# EAGLE design midi10trigger (EAGLE 9.3.1)
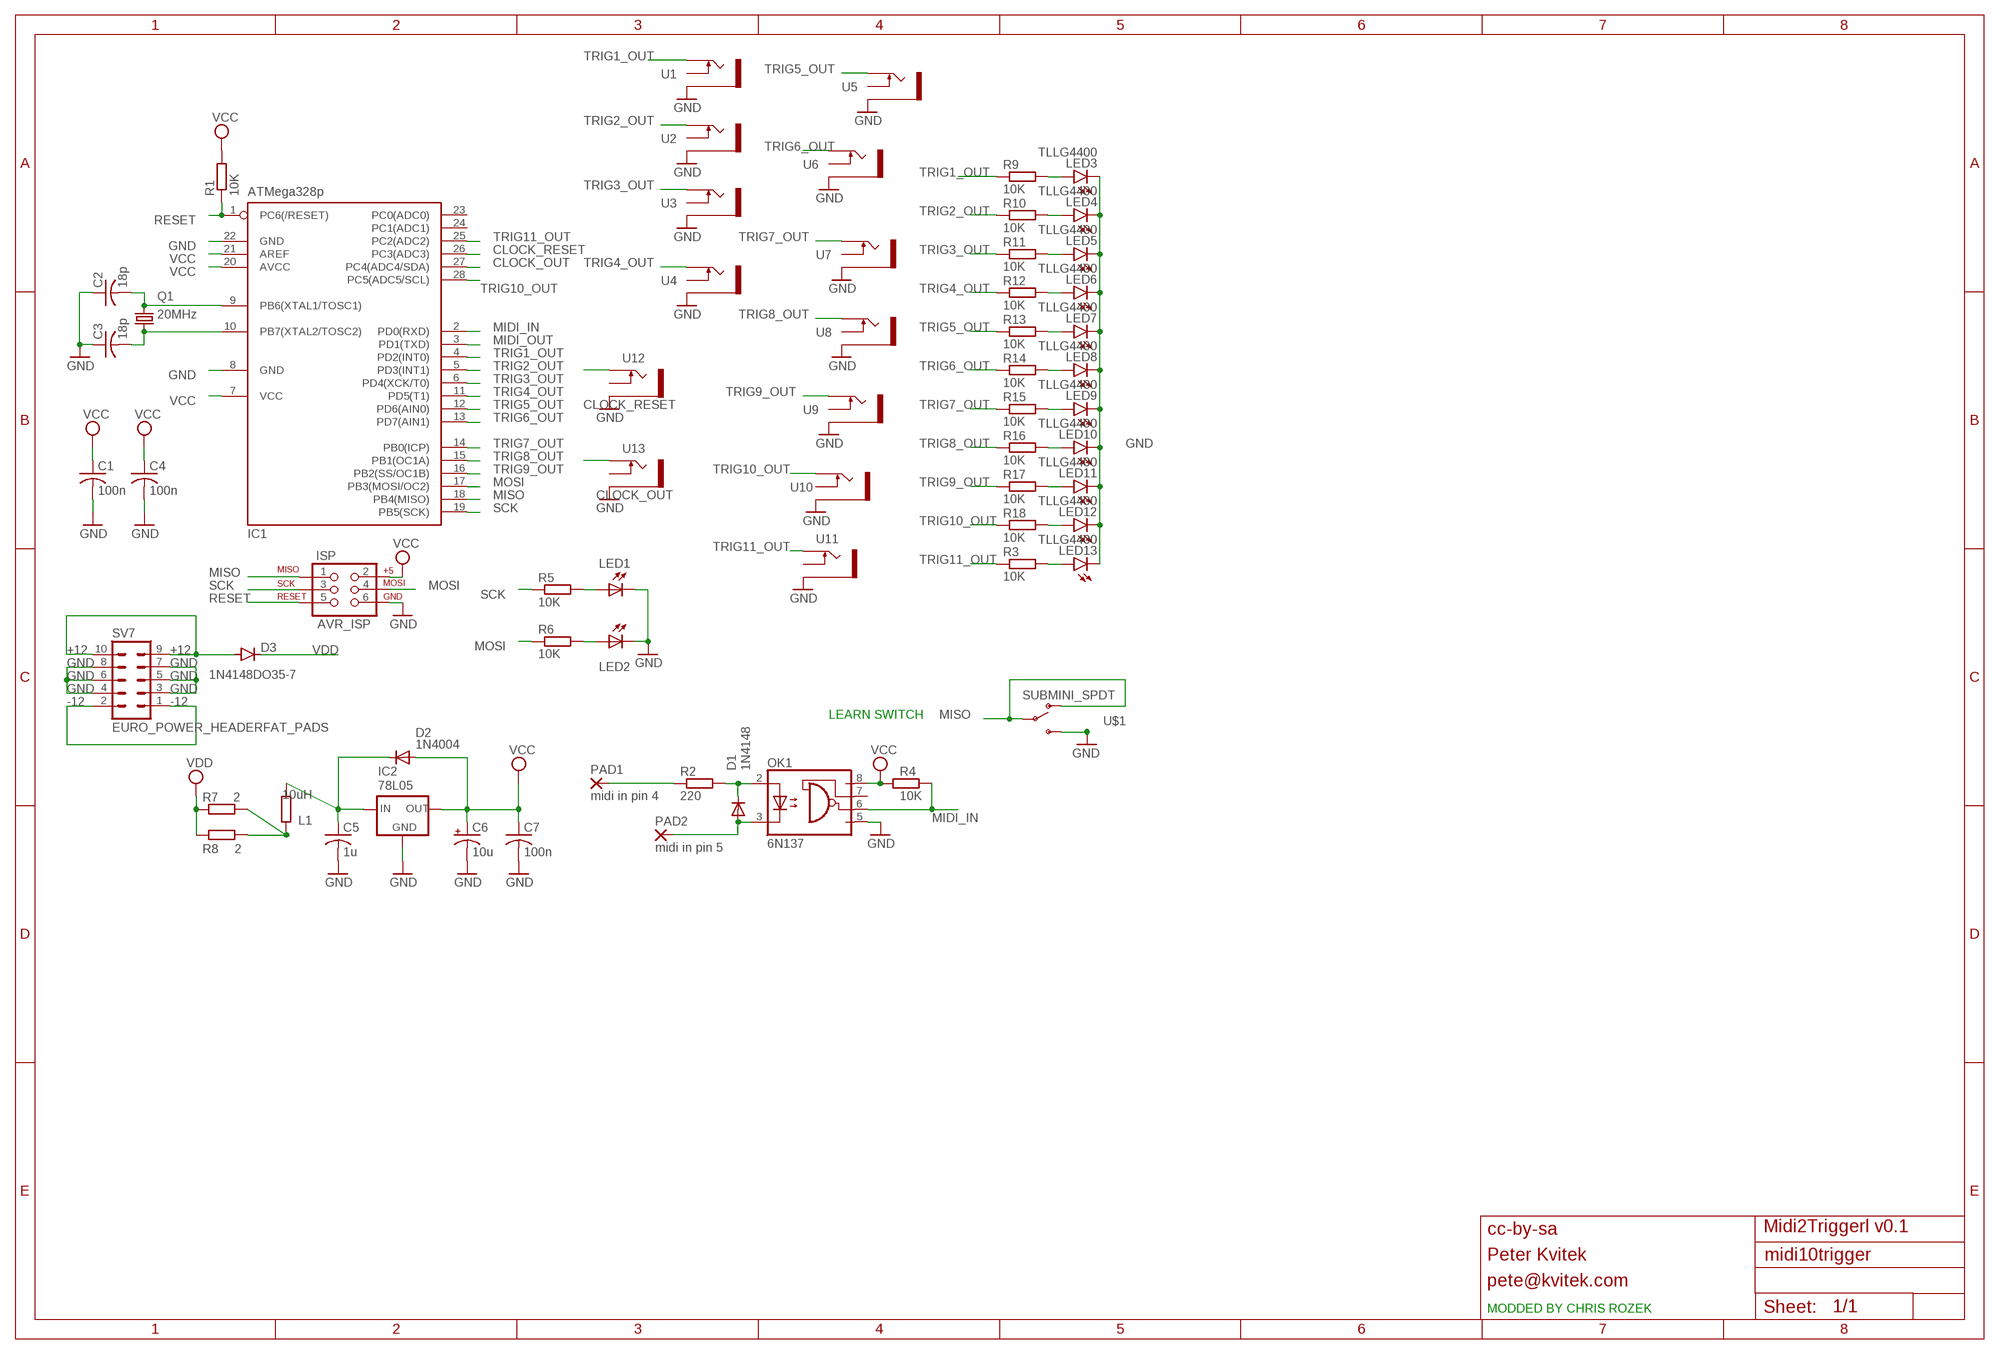
[diagram p0: schematic, sheet 1]

## Parts
C1  100n  C-US025-025X050  [C025-025X050]
C2  18p  C-US025-025X050  [C025-025X050]
C3  18p  C-US025-025X050  [C025-025X050]
C4  100n  C-US025-025X050  [C025-025X050]
C5  1u  C-US025-025X050  [C025-025X050]
C6  10u  CPOL-USE2.5-5  [E2,5-5]
C7  100n  C-US025-025X050  [C025-025X050]
D1  1N4148  DIODE-D-5  [D-5]
D2  1N4004  [DO41-10]
D3  1N4148DO35-7  [DO35-7]
IC1  ATMega328p  MEGA8-P  [DIL28-3]
IC2  78L05  78LXX  [78LXX]
ISP  AVR_ISP  AVR_SPI_PRG_6PTH  [2X3]
L1  10uH  RESISTORVERTICAL  [VERTICAL_RESISTOR]
LED1  LED3MM  [LED3MM]
LED2  LED3MM  [LED3MM]
LED3  TLLG4400  [LED3MM]
LED4  TLLG4400  [LED3MM]
LED5  TLLG4400  [LED3MM]
LED6  TLLG4400  [LED3MM]
LED7  TLLG4400  [LED3MM]
LED8  TLLG4400  [LED3MM]
LED9  TLLG4400  [LED3MM]
LED10  TLLG4400  [LED3MM]
LED11  TLLG4400  [LED3MM]
LED12  TLLG4400  [LED3MM]
LED13  TLLG4400  [LED3MM]
OK1  6N137  [DIL08]
PAD1  midi in pin 4  2,54/1,1  [2,54/1,1]
PAD2  midi in pin 5  2,54/1,1  [2,54/1,1]
Q1  20MHz  CRYSTALHC49U-V  [HC49U-V]
R1  10K  RESISTORVERTICAL  [VERTICAL_RESISTOR]
R2  220  RESISTORVERTICAL  [VERTICAL_RESISTOR]
R3  10K  RESISTORVERTICAL  [VERTICAL_RESISTOR]
R4  10K  RESISTORVERTICAL  [VERTICAL_RESISTOR]
R5  10K  RESISTORVERTICAL  [VERTICAL_RESISTOR]
R6  10K  RESISTORVERTICAL  [VERTICAL_RESISTOR]
R7  2  RESISTORVERTICAL  [VERTICAL_RESISTOR]
R8  2  RESISTORVERTICAL  [VERTICAL_RESISTOR]
R9  10K  RESISTORVERTICAL  [VERTICAL_RESISTOR]
R10  10K  RESISTORVERTICAL  [VERTICAL_RESISTOR]
R11  10K  RESISTORVERTICAL  [VERTICAL_RESISTOR]
R12  10K  RESISTORVERTICAL  [VERTICAL_RESISTOR]
R13  10K  RESISTORVERTICAL  [VERTICAL_RESISTOR]
R14  10K  RESISTORVERTICAL  [VERTICAL_RESISTOR]
R15  10K  RESISTORVERTICAL  [VERTICAL_RESISTOR]
R16  10K  RESISTORVERTICAL  [VERTICAL_RESISTOR]
R17  10K  RESISTORVERTICAL  [VERTICAL_RESISTOR]
R18  10K  RESISTORVERTICAL  [VERTICAL_RESISTOR]
SV7  EURO_POWER_HEADERFAT_PADS  [EURO_PWR_HEADER_FAT]
U1  THONKICONNNEW  [WQP-PJ301M-12_JACK]
U2  THONKICONNNEW  [WQP-PJ301M-12_JACK]
U3  THONKICONNNEW  [WQP-PJ301M-12_JACK]
U4  THONKICONNNEW  [WQP-PJ301M-12_JACK]
U5  THONKICONNNEW  [WQP-PJ301M-12_JACK]
U6  THONKICONNNEW  [WQP-PJ301M-12_JACK]
U7  THONKICONNNEW  [WQP-PJ301M-12_JACK]
U8  THONKICONNNEW  [WQP-PJ301M-12_JACK]
U9  THONKICONNNEW  [WQP-PJ301M-12_JACK]
U10  THONKICONNNEW  [WQP-PJ301M-12_JACK]
U11  THONKICONNNEW  [WQP-PJ301M-12_JACK]
U12  THONKICONNNEW  [WQP-PJ301M-12_JACK]
U13  THONKICONNNEW  [WQP-PJ301M-12_JACK]
U$1  SUBMINI_SPDT  [SUBMINI_TOGGLE]

## Nets
+12: D3.A SV7.9 SV7.10
-12: SV7.1 SV7.2
CLOCK_OUT: IC1.27(PC4(ADC4/SDA)) U13.P$1_TIP(TIP)
CLOCK_RESET: IC1.26(PC3(ADC3)) U12.P$1_TIP(TIP)
GND: C1.2 C2.1 C3.1 C4.2 C5.2 C6.- C7.2 IC1.8(GND) IC1.22(GND) IC2.GND ISP.6 LED1.K(C) LED2.K(C) LED3.K(C) LED4.K(C) LED5.K(C) LED6.K(C) LED7.K(C) LED8.K(C) LED9.K(C) LED10.K(C) LED11.K(C) LED12.K(C) LED13.K(C) OK1.5(GND) SV7.3 SV7.4 SV7.5 SV7.6 SV7.7 SV7.8 U1.P$3_SLEEVE(SLEEVE) U2.P$3_SLEEVE(SLEEVE) U3.P$3_SLEEVE(SLEEVE) U4.P$3_SLEEVE(SLEEVE) U5.P$3_SLEEVE(SLEEVE) U6.P$3_SLEEVE(SLEEVE) U7.P$3_SLEEVE(SLEEVE) U8.P$3_SLEEVE(SLEEVE) U9.P$3_SLEEVE(SLEEVE) U10.P$3_SLEEVE(SLEEVE) U11.P$3_SLEEVE(SLEEVE) U12.P$3_SLEEVE(SLEEVE) U13.P$3_SLEEVE(SLEEVE) U$1.3(S)
MIDI_IN: IC1.2(PD0(RXD)) OK1.6(VO) R4.2
MIDI_OUT: IC1.3(PD1(TXD))
MISO: IC1.18(PB4(MISO)) ISP.1 U$1.1(O) U$1.COM(COMMON)
MOSI: IC1.17(PB3(MOSI/OC2)) ISP.4 R6.1
N$1: L1.1 R7.2 R8.2
N$2: D1.C OK1.2(A) R2.2
N$3: LED13.A R3.2
N$4: LED1.A R5.2
N$5: LED2.A R6.2
N$17: LED3.A R9.2
N$18: LED4.A R10.2
N$19: LED5.A R11.2
N$20: LED6.A R12.2
N$21: LED7.A R13.2
N$22: LED8.A R14.2
N$23: LED9.A R15.2
N$24: LED10.A R16.2
N$25: LED11.A R17.2
N$26: LED12.A R18.2
N$72: PAD1.1(P) R2.1
N$73: D1.A OK1.3(C) PAD2.1(P)
N$82: C3.2 IC1.10(PB7(XTAL2/TOSC2)) Q1.1
N$83: C2.2 IC1.9(PB6(XTAL1/TOSC1)) Q1.2
RESET: IC1.1(PC6(/RESET)) ISP.5 R1.1
SCK: IC1.19(PB5(SCK)) ISP.3 R5.1
TRIG1_OUT: IC1.4(PD2(INT0)) R9.1 U1.P$1_TIP(TIP)
TRIG2_OUT: IC1.5(PD3(INT1)) R10.1 U2.P$1_TIP(TIP)
TRIG3_OUT: IC1.6(PD4(XCK/T0)) R11.1 U3.P$1_TIP(TIP)
TRIG4_OUT: IC1.11(PD5(T1)) R12.1 U4.P$1_TIP(TIP)
TRIG5_OUT: IC1.12(PD6(AIN0)) R13.1 U5.P$1_TIP(TIP)
TRIG6_OUT: IC1.13(PD7(AIN1)) R14.1 U6.P$1_TIP(TIP)
TRIG7_OUT: IC1.14(PB0(ICP)) R15.1 U7.P$1_TIP(TIP)
TRIG8_OUT: IC1.15(PB1(OC1A)) R16.1 U8.P$1_TIP(TIP)
TRIG9_OUT: IC1.16(PB2(SS/OC1B)) R17.1 U9.P$1_TIP(TIP)
TRIG10_OUT: IC1.28(PC5(ADC5/SCL)) R18.1 U10.P$1_TIP(TIP)
TRIG11_OUT: IC1.25(PC2(ADC2)) R3.1 U11.P$1_TIP(TIP)
VCC: C1.1 C4.1 C6.+ C7.1 D2.A IC1.7(VCC) IC1.20(AVCC) IC1.21(AREF) IC2.OUT ISP.2 OK1.8(VCC) R1.2 R4.1
VDD: D3.C R7.1 R8.1
VREG_IN: C5.1 D2.C IC2.IN L1.2
Unconnected: IC1.23(PC0(ADC0)) IC1.24(PC1(ADC1)) OK1.7(VE) U1.P$2_SWITCH(SWITCH) U2.P$2_SWITCH(SWITCH) U3.P$2_SWITCH(SWITCH) U4.P$2_SWITCH(SWITCH) U5.P$2_SWITCH(SWITCH) U6.P$2_SWITCH(SWITCH) U7.P$2_SWITCH(SWITCH) U8.P$2_SWITCH(SWITCH) U9.P$2_SWITCH(SWITCH) U10.P$2_SWITCH(SWITCH) U11.P$2_SWITCH(SWITCH) U12.P$2_SWITCH(SWITCH) U13.P$2_SWITCH(SWITCH)

## Notes on the sheet
- LEARN SWITCH
- cc-by-sa | Midi2Triggerl v0.1
- Peter Kvitek
- pete@kvitek.com
- MODDED BY CHRIS ROZEK

## Library data of the parts
C1-C5 C7 = rcl:C-US: CAPACITOR, American symbol
C6 = rcl:CPOL-US: POLARIZED CAPACITOR, American symbol
D1 = diode:DIODE-: DIODE
D2 = diode:1N4004: DIODE general purpose rectifier, 1 A
D3 = diode:1N4148: DIODE high speed (Philips)
IC1 = atmel:MEGA8-P: MICROCONTROLLER 8 Kbytes FLASH, 1 kbytes SRAM, 512 bytes EEPROM, USART, 4-channel 10 bit ADC, 2-channel 8 bit ADC Pin compatible with Atmega48, ATMega88, ATMega168 Source: avr.lbr; OC_FARNELL: unknown; OC_NEWARK: unknown
IC2 = v-reg:78LXX: VOLTAGE REGULATOR
ISP = SparkFun:AVR_SPI_PRG_6: AVR ISP 6 Pin This is the reduced ISP connector for AVR programming. Common on Arduino. This footprint will take up less PCB space and can be used with a 10-pin to 6-pin adapter such as SKU: BOB-08508
L1 R1-R18 = MusicThingModular:RESISTOR: Standard resistor, various versions
LED1 LED2 = led:LED: LED OSRAM: - CHIPLED LG R971, LG N971, LY N971, LG Q971, LY Q971, LO R971, LY R971 LH N974, LH R974 LS Q976, LO Q976, LY Q976 LO Q996 - Hyper CHIPLED LW Q18S LB Q993, LB Q99A, LB R99A - SideLED LS A670, LO A670, LY A670, LG A670, LP A670 LB A673, LV A673, LT A673, LW A673 LH A674 LY A675 LS A676, LA A676, LO A676, LY A676, LW A676 LS A679, LY A679, LG A679 - Hyper Micro SIDELED® LS Y876, LA Y876, LO Y876, LY Y876 LT Y87S - SmartLED LW L88C, LW L88S LB L89C, LB L89S, LG L890 LS L89K, LO L89K, LY L89K LS L896, LA L896, LO L896, LY L896 - TOPLED LS T670, LO T670, LY T670, LG T670, LP T670 LSG T670, LSP T670, LSY T670, LOP T670, LYG T670 LG T671, LOG T671, LSG T671 LB T673, LV T673, LT T673, LW T673 LH T674 LS T676, LA T676, LO T676, LY T676, LB T676, LH T676, LSB T676, LW T676 LB T67C, LV T67C, LT T67C, LS T67K, LO T67K, LY T67K, LW E67C LS E67B, LA E67B, LO E67B, LY E67B, LB E67C, LV E67C, LT E67C LW T67C LS T679, LY T679, LG T679 LS T770, LO T770, LY T770, LG T770, LP T770 LB T773, LV T773, LT T773, LW T773 LH T774 LS E675, LA E675, LY E675, LS T675 LS T776, LA T776, LO T776, LY T776, LB T776 LHGB T686 LT T68C, LB T68C - Hyper Mini TOPLED® LB M676 - Mini TOPLED Santana® LG M470 LS M47K, LO M47K, LY M47K Source: http://www.osram.convergy.de LUXEON: - LUMILED® LXK2-PW12-R00, LXK2-PW12-S00, LXK2-PW14-U00, LXK2-PW14-V00 LXK2-PM12-R00, LXK2-PM12-S00, LXK2-PM14-U00 LXK2-PE12-Q00, LXK2-PE12-R00, LXK2-PE12-S00, LXK2-PE14-T00, LXK2-PE14-U00 LXK2-PB12-K00, LXK2-PB12-L00, LXK2-PB12-M00, LXK2-PB14-N00, LXK2-PB14-P00, LXK2-PB14-Q00 LXK2-PR12-L00, LXK2-PR12-M00, LXK2-PR14-Q00, LXK2-PR14-R00 LXK2-PD12-Q00, LXK2-PD12-R00, LXK2-PD12-S00 LXK2-PH12-R00, LXK2-PH12-S00 LXK2-PL12-P00, LXK2-PL12-Q00, LXK2-PL12-R00 Source: www.luxeon.com KINGBRIGHT: KA-3528ASYC Source: www.kingbright.com
LED3-LED13 = led:TLLG4400: Low Current (2mA) LED 3 mm Tinted Diffused Package color GREEN Source: Data sheet <http://www.farnell.com/datasheets/391098.pdf>; MF: VISHAY SEMICONDUCTOR; OC_FARNELL: 1612435
OK1 = kvitekp:6N137: MOTOROLA OPTO COUPLER; MPN: 6N137; OC_FARNELL: 1328376; OC_NEWARK: 52M1895
PAD1 PAD2 = wirepad:2,54/1,1: THROUGH-HOLE PAD
Q1 = crystal:CRYSTAL: CRYSTAL; OC_FARNELL: 1666969; OC_NEWARK: unknown
SV7 = MusicThingModular:EURO_POWER_HEADER: Power Header 10 pin power header for Eurorack Power Supplies Variants with fatter pads for easier soldering, and the LOCK variant which has 5mil offset pins to hold the component in place before soldering
U1-U13 = MusicThingModular:THONKICONN: 3.5mm socket for Eurorack modular synths
U$1 = MusicThingModular:SUBMINI_SPDT

## Net classes
0 default: width 0.635 mm, drill 0.254 mm, clearance 0.254 mm
1 bigger: width 1.27 mm, drill 0.508 mm, clearance 0.635 mm

## Board
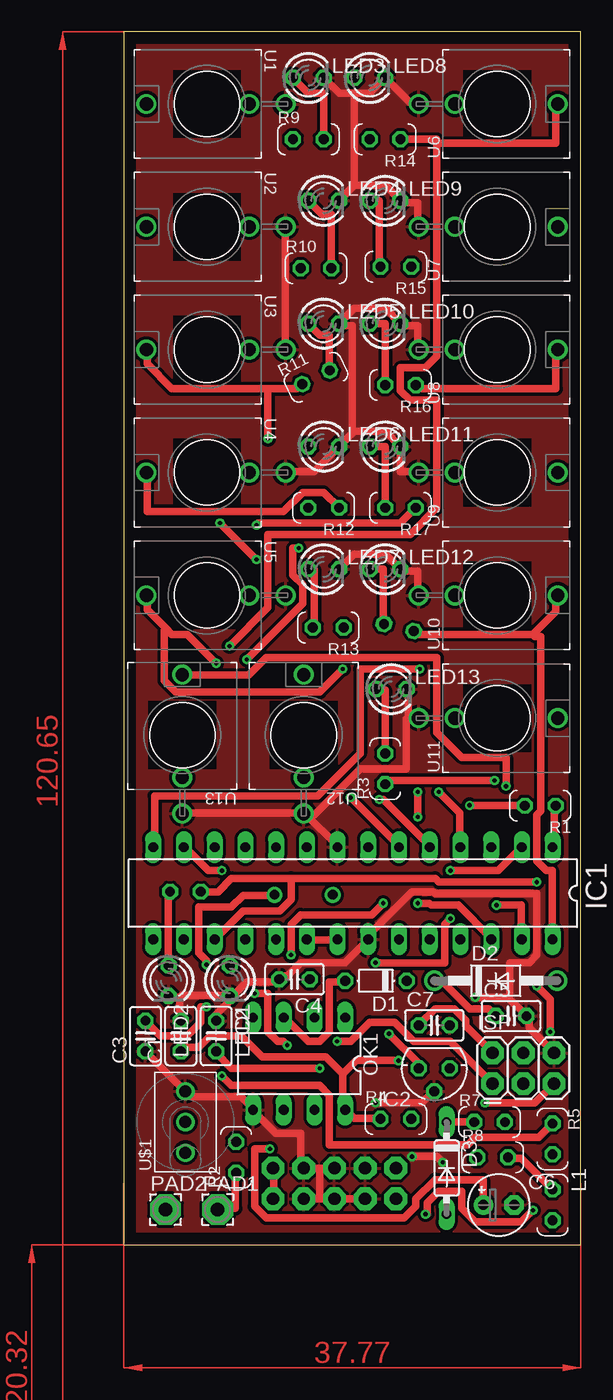
[diagram p1: board, top side]
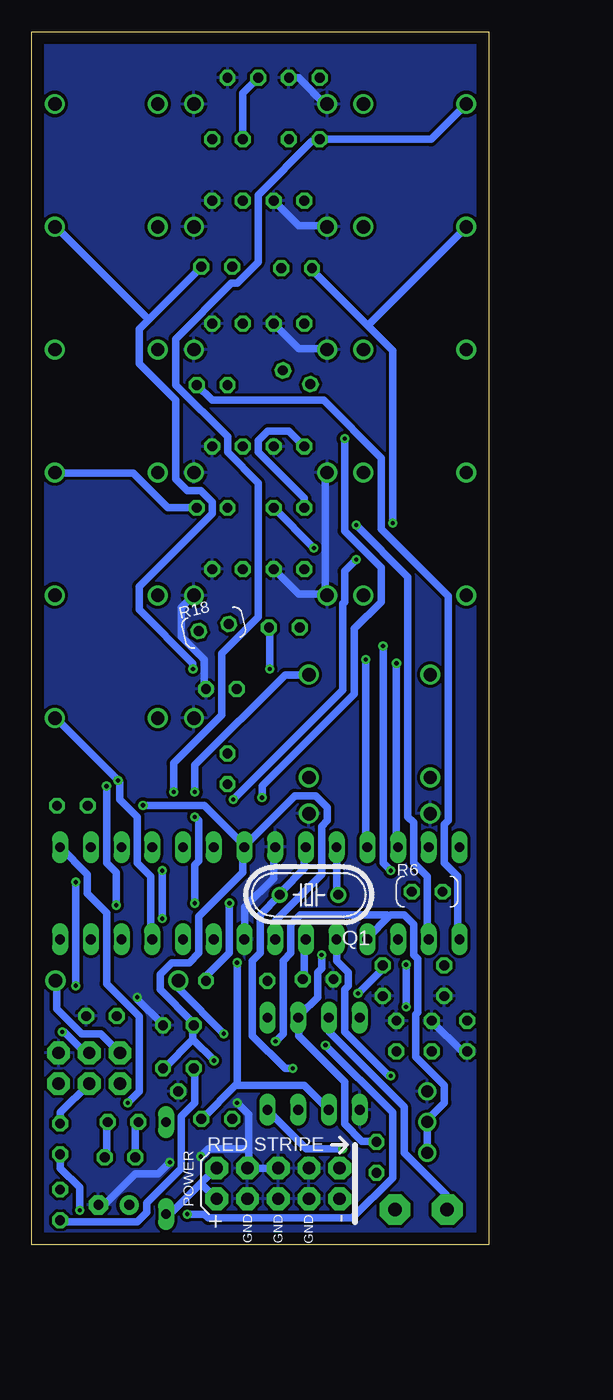
[diagram p2: board, bottom side, seen from below]

Size 37.77 x 100.32 mm. Coordinates in mm from the lower left corner, seen from the top.
Outline: 0,0 37.77,0 37.77,100.32 0,100.32 0,0
Copper layers (1*16): Top 0.035mm / dielectric 1.5mm / Bottom 0.035mm
Design rules "default": minimum track width 6mil, minimum drill 0.35mm, track to track 6mil, track to pad 6mil, pad to pad 6mil, via to via 6mil, smd to smd 6mil, copper to edge 40mil, drill to drill 6mil, minimum pad ring 10mil, minimum via ring 8mil, stop-mask expansion 4mil, vias tented up to drill 0mil, thermal gap 10mil

### Footprints (pad centres in the part's own frame; a part is rotated, then mirrored left to right if it is on the bottom)
C025-025X050 = drill 0.813 octagon: 1 -1.27,0; 2 1.27,0
E2,5-5 = drill 0.813 pad 1.6: + -1.27,0 | drill 0.813 pad 1.6 octagon: - 1.27,0
D-5 = drill 0.813 octagon: A 2.54,0; C -2.54,0
DO41-10 = drill 1.118: A 5.08,0; C -5.08,0
DO35-7 = drill 0.813 long: A 3.81,0; C -3.81,0
DIL28-3 = drill 0.813 long: 1 -16.51,-3.81; 2 -13.97,-3.81; 3 -11.43,-3.81; 4 -8.89,-3.81; 5 -6.35,-3.81; 6 -3.81,-3.81; 7 -1.27,-3.81; 8 1.27,-3.81; 9 3.81,-3.81; 10 6.35,-3.81; 11 8.89,-3.81; 12 11.43,-3.81; 13 13.97,-3.81; 14 16.51,-3.81; 15 16.51,3.81; 16 13.97,3.81; 17 11.43,3.81; 18 8.89,3.81; 19 6.35,3.81; 20 3.81,3.81; 21 1.27,3.81; 22 -1.27,3.81; 23 -3.81,3.81; 24 -6.35,3.81; 25 -8.89,3.81; 26 -11.43,3.81; 27 -13.97,3.81; 28 -16.51,3.81
78LXX = drill 0.813 octagon: GND 0,1.905; IN 1.27,0; OUT -1.27,0
2X3 = drill 1.016 pad 1.88 octagon: 1 0,0; 2 0,2.54; 3 2.54,0; 4 2.54,2.54; 5 5.08,0; 6 5.08,2.54
VERTICAL_RESISTOR = drill 0.813 octagon: 1 -1.27,0; 2 1.27,0
LED3MM = drill 0.813 octagon: A -1.27,0; K 1.27,0
DIL08 = drill 0.813 long: 1 -3.81,-3.81; 2 -1.27,-3.81; 3 1.27,-3.81; 4 3.81,-3.81; 5 3.81,3.81; 6 1.27,3.81; 7 -1.27,3.81; 8 -3.81,3.81
2,54/1,1 = drill 1.118 pad 2.54 octagon: 1 0,0
HC49U-V = drill 0.813: 1 -2.413,0; 2 2.413,0
EURO_PWR_HEADER_FAT = drill 1.016 pad 1.88 octagon: 1 -5.08,-1.27; 2 -5.08,1.27; 3 -2.54,-1.27; 4 -2.54,1.27; 5 0,-1.27; 6 0,1.27; 7 2.54,-1.27; 8 2.54,1.27; 9 5.08,-1.27; 10 5.08,1.27
WQP-PJ301M-12_JACK = drill 1.1: P$1_TIP 0,5; P$2_SWITCH 0,-3.5; P$3_SLEEVE 0,-6.5
SUBMINI_TOGGLE = drill 1 pad 1.422: 1 -2.54,0; 3 2.54,0; COM 0,0

### Placement (x,y rotation side)
C1  4.7,17.27 90 top
C2  7.62,17.27 270 top
C3  1.78,17.27 90 top
C4  14.1,21.97 180 top
C5  32,18.92 0 top
C6  30.99,3.3 0 top
C7  25.65,18.16 0 top
D1  20.83,21.84 180 top
D2  30.73,21.84 0 top
D3  26.67,6.35 270 top
IC1  18.92,29.08 180 top
IC2  25.65,14.6 180 top
ISP  30.48,13.34 0 top
L1  35.43,3.3 270 top
LED1  8.76,21.84 270 top
LED2  3.68,21.84 270 top
LED3  15.24,96.52 0 top
LED4  16.51,86.36 0 top
LED5  16.51,76.2 0 top
LED6  16.51,66.04 0 top
LED7  16.51,55.88 0 top
LED8  20.32,96.52 0 top
LED9  21.59,86.36 0 top
LED10  21.59,76.2 0 top
LED11  21.59,66.04 0 top
LED12  21.59,55.88 0 top
LED13  22.1,45.97 0 top
OK1  14.48,14.99 180 top
PAD1  7.75,2.92 0 top
PAD2  3.43,2.92 0 top
Q1  14.86,28.96 180 bottom
R1  34.42,36.32 180 top
R2  9.27,7.24 90 top
R3  21.59,39.37 90 top
R4  22.48,10.41 0 top
R5  35.43,8.76 270 top
R6  5.08,29.21 0 bottom
R7  30.23,10.16 0 top
R8  30.48,7.24 0 top
R9  15.24,91.44 0 top
R10  15.88,80.77 0 top
R11  15.88,71.75 26.5 top
R12  16.51,60.96 180 top
R13  16.89,51.05 180 top
R14  21.59,91.44 180 top
R15  22.48,80.9 180 top
R16  22.86,71.12 180 top
R17  22.86,60.96 180 top
R18  22.73,51.05 13.3 bottom
SV7  17.4,5.08 180 bottom
U1  6.86,94.36 90 top
U2  6.86,84.2 90 top
U3  6.86,74.04 90 top
U4  6.86,63.88 90 top
U5  6.86,53.72 90 top
U6  30.86,94.36 270 top
U7  30.86,84.2 270 top
U8  30.86,74.04 270 top
U9  30.86,63.88 270 top
U10  30.86,53.72 270 top
U11  30.86,43.56 270 top
U12  14.86,42.16 0 top
U13  4.83,42.16 0 top
U$1  5.08,10.16 90 top

### Tracks (layer width: path | path; a pad name or v marks a point on that pad's centre or on a via)
+12
  Bottom 0.635: D3.A 26.35,2.54 23.81,5.08 | 23.81,5.08 22.54,6.35 SV7.9 | 23.81,5.08 22.54,3.81 SV7.10
-12
  Top 0.635: SV7.2 12.38,3.81 12.38,6.35 SV7.1
CLOCK_OUT  (via drill 0.35)
  Top 0.635: v30.8,28.1 32.86,28.1 32.86,25.4 IC1.27 | v31.59,37.94 31.59,40.32 27.94,40.32 25.88,42.39 25.88,48.58 11.75,48.58 10.32,47.15 4.92,47.15 U13.P$1_TIP
  Bottom 0.635: v30.8,28.1 30.8,30.8 31.59,31.59 v31.59,37.94
CLOCK_RESET  (via drill 0.35)
  Top 0.635: v24.29,28.26 25.24,28.26 25.4,28.1 27.62,28.1 30.32,25.4 IC1.26 | v24.29,37.46 v24.29,35.4
  Bottom 0.635: v24.29,28.26 24.29,31.43 23.97,31.75 23.97,35.08 v24.29,35.4 | v24.29,37.46 24.29,39.69 16.83,47.15 14.92,47.15 U12.P$1_TIP
GND  (via drill 0.35)
  Top 0.635: 19.05,87.63 LED4.K | 19.05,87.63 21.59,87.63 LED9.K 23.02,86.2 24.29,86.2 24.29,84.3 U7.P$3_SLEEVE | U6.P$3_SLEEVE 24.29,94.46 23.65,94.46 LED8.K 20.32,95.25 19.05,95.25 | 19.05,95.25 17.78,95.25 LED3.K | 19.05,95.25 19.05,87.63 | 23.5,43.66 23.5,45.88 LED13.K | 23.5,43.66 24.29,43.66 U11.P$3_SLEEVE | LED7.K 19.05,57.15 21.59,57.15 LED12.K 23.02,55.72 24.29,55.72 24.29,53.82 U10.P$3_SLEEVE | U9.P$3_SLEEVE 24.29,63.98 22.86,63.98 LED11.K 21.59,67.31 19.05,67.31 | U4.P$3_SLEEVE 13.49,63.98 15.72,63.98 LED6.K 19.05,67.31 | U8.P$3_SLEEVE 24.29,74.14 24.29,76.04 23.02,76.04 LED10.K 21.59,77.47 19.05,77.47 LED5.K 17.94,76.04 18.89,76.04 18.89,67.47 19.05,67.31 | U2.P$3_SLEEVE 13.34,84.14 13.34,74.14 U3.P$3_SLEEVE | 16.19,3.81 SV7.6 SV7.8 | 16.19,3.81 SV7.4 | SV7.5 16.19,6.35 | 16.19,6.35 SV7.3 14.61,6.51 14.61,9.21 12.54,9.21 10.79,10.95 OK1.5 10.64,11.27 9.68,12.22 5.56,12.22 U$1.3 C3.1 | v20.8,11.75 24.61,11.75 25.56,12.7 IC2.GND | v26.35,6.83 25.88,7.3 v23.81,7.3 | 16.19,6.35 16.19,3.81 | IC1.8 17.62,33.02 15.08,35.56 14.92,35.56 U12.P$3_SLEEVE | U13.P$3_SLEEVE 4.92,35.72 14.61,35.72 U12.P$3_SLEEVE | 31.75,20.48 v29.05,20.48 | 31.75,20.48 33.18,19.05 C5.2 33.5,18.73 33.5,17.94 ISP.6 | 4.6,20.48 4.6,18.57 C1.2 | 4.6,20.48 3.81,20.48 LED2.K | C2.1 7.62,19.05 8.73,20.16 8.73,20.48 LED1.K | LED1.K 9.05,20.64 10.16,21.75 12.54,21.75 12.7,21.91 C4.2 13.02,22.23 13.49,22.23 14.61,23.34 18.26,23.34 IC1.22 20.16,25.56 23.81,29.21 25.56,29.21 25.72,29.05 34.13,29.05 34.13,23.97 33.5,23.34 31.91,23.34 31.91,20.64 31.75,20.48 | 4.6,20.48 4.76,20.64 8.57,20.64 LED1.K | 23.5,43.66 23.34,43.5 23.34,39.37 19.53,39.37 15.56,35.4 U12.P$3_SLEEVE
  Bottom 0.635: LED4.K 15.72,84.3 13.49,84.3 U2.P$3_SLEEVE | LED3.K 15.72,96.52 13.49,94.3 U1.P$3_SLEEVE | LED7.K 15.72,53.82 13.49,53.82 U5.P$3_SLEEVE 13.49,54.13 13.49,63.82 U4.P$3_SLEEVE | LED13.K 23.5,46.04 23.5,48.42 25.4,50.32 25.4,52.71 24.45,53.66 U10.P$3_SLEEVE | LED5.K 15.72,74.14 13.49,74.14 U3.P$3_SLEEVE | v20.8,11.75 19.84,10.79 19.84,7.94 | 19.84,7.94 19.84,6.35 SV7.7 SV7.5 | v26.35,6.83 27.3,5.87 29.21,5.87 31.75,3.33 32.23,3.33 C6.- | v23.81,7.3 23.18,7.94 19.84,7.94 | v29.05,20.48 29.05,20.32 26.99,18.26 C7.2 | C3.1 1.91,16.03 2.22,16.03 4.6,18.41 C1.2 | IC1.8 17.78,32.86 17.78,30.32 20.16,27.94 20.16,25.4 IC1.22
  pour Top: -1.27,102.87 39.37,102.87 40.64,104.14 40.64,-3.81 0,-3.81 -1.27,-2.54
  pour Bottom: 0,100.33 38.1,100.33 38.1,0 0,0
MIDI_IN  (via drill 0.35)
  Top 0.635: IC1.2 30.96,30.96 v26.99,30.96 | v26.99,26.99 26.51,26.51 26.51,23.34 v20.8,23.34
  Bottom 0.635: 20.8,13.18 20.95,13.18 23.65,10.48 R4.2 | 20.8,13.18 15.24,13.18 13.34,11.27 OK1.6 | v26.99,26.99 v26.99,30.96 | 20.8,13.18 v20.8,23.34
MISO  (via drill 0.35)
  Top 0.635: ISP.1 26.99,16.83 23.97,16.83 22.38,18.41 20.32,18.41 18.73,16.83 v17.62,16.83
  Bottom 0.635: 8.26,27.15 8.1,27.3 6.99,27.3 6.19,26.51 6.19,23.97 5.87,23.65 5.87,19.21 6.03,19.05 6.03,15.56 3.65,13.18 3.65,11.75 5.08,10.32 U$1.COM U$1.1 | 8.26,27.15 10,25.4 IC1.18 | v17.62,16.83 16.99,17.46 16.99,23.49 16.35,24.13 16.35,26.51 15.56,27.3 8.41,27.3 8.26,27.15
MOSI  (via drill 0.35)
  Top 0.635: IC1.17 9.84,27.62 12.86,27.62 13.81,28.58 13.81,30.32 | 13.81,30.32 8.89,30.32 7.78,29.21 R6.1 | v35.24,17.62 35.24,20.32 v34.13,21.43 | v34.13,30 26.04,30 25.72,30.32 13.81,30.32
  Bottom 0.635: ISP.4 33.34,15.88 35.08,17.62 v35.24,17.62 | v34.13,30 v34.13,21.43
N$1
  Top 0.635: L1.1 32.86,7.14 31.75,7.14 R8.2
  Bottom 0.635: R7.2 31.59,10.16 31.59,7.46 31.75,7.3 R8.2
N$2  (via drill 0.35)
  Top 0.635: v21.43,28.26 20.48,27.3 14.61,27.3 13.81,26.51 v13.81,23.97
  Bottom 0.635: R2.2 9.37,8.57 10.48,8.57 11.91,10 11.91,13.49 15.72,17.3 15.72,18.73 OK1.2 15.56,19.05 14.13,20.48 14.13,22.54 13.81,22.86 v13.81,23.97 | v21.43,28.26 21.43,24.13 23.34,22.23 23.34,21.91 D1.C
N$3
  Top 0.635: R3.2 21.59,45.88 20.95,45.88 LED13.A
N$4  (via drill 0.35)
  Top 0.635: v33.81,2.86 32.86,1.91 29.05,1.91 27.94,3.02 27.94,4.45 26.04,4.45 25.08,3.49 25.08,2.54 v24.92,2.54 | v13.49,16.51 13.18,16.83 12.7,16.83 11.91,17.62 11.91,20.8 v10.79,20.8
  Bottom 0.635: v33.81,2.86 33.81,4.76 35.4,6.35 35.4,7.46 R5.2 | v24.92,2.54 23.5,2.54 23.18,2.22 11.27,2.22 7.94,5.56 7.94,10.95 v13.49,16.51 | v10.79,20.8 8.89,22.7 8.89,23.02 LED1.A
N$5
  Top 0.635: R6.2 3.65,29.21 3.65,23.18 LED2.A
N$17
  Top 0.635: R9.2 16.51,95.25 15.24,95.25 LED3.A
N$18
  Top 0.635: R10.2 17.14,85.25 16.35,85.25 LED4.A
N$19
  Top 0.635: LED5.A 16.19,75.25 16.99,75.25 16.99,72.39 R11.2
N$20
  Bottom 0.635: R12.2 15.24,61.75 19.05,65.56 19.05,66.52 18.26,67.31 16.51,67.31 LED6.A
N$21
  Top 0.635: LED7.A 15.72,55.88 15.72,51.12 R13.2
N$22
  Bottom 0.635: R14.2 20.32,95.25 LED8.A
N$23
  Top 0.635: LED9.A 21.11,86.36 21.11,80.96 R15.2
N$24
  Top 0.635: R16.2 21.59,76.2 LED10.A
N$25
  Top 0.635: R17.2 21.59,66.04 LED11.A
N$26
  Top 0.635: LED12.A 21.43,55.88 21.43,51.43 R18.2
N$72
  Top 0.635: R2.1 9.21,5.87 9.21,3.02 7.78,3.02 PAD1.1
N$73
  Top 0.635: OK1.3 13.34,18.73 15.24,16.83 16.19,16.83 16.99,17.62 16.99,21.75 18.26,21.75 D1.A
  Bottom 0.635: PAD2.1 3.49,3.02 3.49,4.13 6.99,7.62 6.99,11.43 13.18,17.62 13.18,18.73 OK1.3
N$82  (via drill 0.35)
  Top 0.635: C3.2 3.02,17.3 5.24,17.3 6.35,18.41 6.35,19.69 v6.83,19.69 | v6.83,23.18 6.83,23.49 6.19,24.13 6.19,27.94 8.89,27.94 9.84,28.89 12.38,28.89 Q1.1
  Bottom 0.635: v6.83,23.18 v6.83,19.69 | IC1.10 12.54,32.86 12.54,29.05 Q1.1
N$83  (via drill 0.35)
  Top 0.635: v16.19,14.6 8.89,14.6 7.62,15.88 C2.2
  Bottom 0.635: v16.19,14.6 16.83,14.6 19.53,17.3 19.53,23.49 18.89,24.13 18.89,27.3 17.3,28.89 Q1.2 17.14,29.21 15.24,31.12 15.24,32.86 IC1.9
RESET  (via drill 0.35)
  Top 0.635: IC1.1 35.56,33.02 35.56,36.2 R1.1 | ISP.5 33.97,11.75 v29.84,11.75
  Bottom 0.635: v29.84,11.75 28.89,12.7 28.89,18.89 31.59,21.59 31.59,27.46 33.18,29.05 33.18,30.64 IC1.1
SCK  (via drill 0.35)
  Top 0.635: v8.1,13.97 8.89,13.18 16.19,13.18 16.99,12.38 16.99,8.25 28.42,8.25 29.05,8.89 34.29,8.89 R5.1
  Bottom 0.635: ISP.3 35.4,10.95 35.4,10.16 R5.1 | v8.1,13.97 8.26,13.97 11.91,17.62 11.91,21.11 11.59,21.43 11.59,22.54 12.54,23.49 12.54,25.24 IC1.19
TRIG1_OUT  (via drill 0.35)
  Top 0.635: v26.04,37.46 27.78,35.72 27.78,33.02 IC1.4
  Bottom 0.635: U1.P$1_TIP 1.91,94.3 4.76,91.44 R9.1 14.13,91.28 14.61,91.28 19.05,86.84 19.05,81.28 20.8,79.53 21.27,79.53 25.88,74.93 25.88,71.12 21.59,66.83 21.59,65.56 19.05,63.02 19.05,51.91 22.07,48.9 22.07,43.82 26.04,39.85 v26.04,37.46
TRIG2_OUT  (via drill 0.35)
  Top 0.635: v21.11,36.83 21.43,36.83 25.24,33.02 IC1.5 | v7.94,59.69 v10.95,56.67
  Bottom 0.635: v21.11,36.83 12.06,45.88 12.06,53.02 11.91,53.18 11.91,55.72 v10.95,56.67 | v7.94,59.69 7.94,73.98 10,76.04 | 10,76.04 14.61,80.65 R10.1 | 10,76.04 1.91,84.14 U2.P$1_TIP
TRIG3_OUT  (via drill 0.35)
  Top 0.635: 11.91,70.8 3.97,70.8 1.91,72.87 1.91,73.98 U3.P$1_TIP | 11.91,70.8 14.29,70.8 14.61,71.12 R11.1 | v18.73,36.99 22.7,33.02 IC1.6 | 11.91,70.8 v11.91,66.68
  Bottom 0.635: v18.73,36.99 18.73,37.94 11.11,45.56 11.11,50.96 8.89,53.18 8.89,56.04 11.91,59.05 v11.91,66.68
TRIG4_OUT  (via drill 0.35)
  Top 0.635: v10.16,48.42 14.76,53.02 14.76,54.61 13.97,55.4 13.97,57.63 v14.45,57.63 | R12.1 16.51,62.23 14.76,62.23 13.18,60.64 1.91,60.64 1.91,63.82 U4.P$1_TIP
  Bottom 0.635: v10.16,48.42 10.16,33.02 IC1.11 | R12.1 v14.45,57.63
TRIG5_OUT  (via drill 0.35)
  Top 0.635: v7.62,48.1 5.24,50.48 3.97,50.48 3.49,50.96 | 3.49,50.96 1.91,52.55 1.91,53.66 U5.P$1_TIP | v18.1,47.62 16.19,45.72 4.29,45.72 3.33,46.67 3.33,50.8 3.49,50.96
  Bottom 0.635: v7.62,48.1 7.62,33.02 IC1.12 | v18.1,47.62 18.1,50.96 R13.1
TRIG6_OUT  (via drill 0.35)
  Top 0.635: v8.1,30.96 6.99,30.96 5.08,32.86 IC1.13 | v8.73,49.53 11.91,52.71 11.91,58.74 23.65,58.74 25.88,60.96 25.88,69.85 23.65,69.85 22.86,70.64 22.86,72.55 24.92,72.55 25.88,73.5 25.88,91.12 | 25.88,91.12 25.88,91.44 R14.1 | 25.88,91.12 35.72,91.12 35.72,94.3 U6.P$1_TIP
  Bottom 0.635: v8.1,30.96 8.73,31.59 v8.73,49.53
TRIG7_OUT  (via drill 0.35)
  Top 0.635: v24.45,47.62 19.53,47.62 19.53,40.64 16.03,37.15 2.54,37.15 2.54,33.02 IC1.14
  Bottom 0.635: v24.45,47.62 24.45,48.1 28.89,52.55 28.89,54.45 22.86,60.48 22.86,61.44 23.81,62.39 24.92,62.39 25.88,63.34 25.88,69.85 28.89,72.87 28.89,75.72 28.1,76.52 | 28.1,76.52 23.81,80.8 R15.1 | 28.1,76.52 35.72,84.14 U7.P$1_TIP
TRIG8_OUT
  Top 0.635: R16.1 24.45,70.8 35.72,70.8 35.72,73.98 U8.P$1_TIP
  Bottom 0.635: R16.1 22.86,69.85 13.65,69.85 8.89,65.09 8.89,59.21 3.33,53.66 3.33,35.08 3.65,34.77 3.65,31.59 2.54,30.48 2.54,25.4 IC1.15
TRIG9_OUT  (via drill 0.35)
  Top 0.635: v10.95,59.53 11.11,59.69 22.86,59.69 R17.1
  Bottom 0.635: v10.95,59.53 6.67,55.24 6.67,35.4 6.19,34.92 6.19,31.59 5.08,30.48 5.08,25.4 IC1.16 | R17.1 26.51,60.96 29.37,63.82 35.72,63.82 U9.P$1_TIP
TRIG10_OUT
  Top 0.635: 33.81,50.48 24.13,50.48 23.97,50.64 R18.1 | 33.81,50.48 35.72,52.39 35.72,53.66 U10.P$1_TIP | IC1.28 35.4,25.4 35.4,30.96 34.92,30.96 34.13,31.75 34.13,35.56 34.45,35.88 34.45,50.32 33.97,50.32 33.81,50.48
TRIG11_OUT  (via drill 0.35)
  Top 0.635: R3.1 21.91,38.42 v30.64,38.42
  Bottom 0.635: U11.P$1_TIP 35.72,43.5 v30.64,38.42 30.48,38.26 30.48,36.83 29.05,35.4 29.05,31.59 27.94,30.48 27.94,25.4 IC1.25
VCC  (via drill 0.35)
  Top 0.635: R4.1 21.11,10.48 19.05,10.48 18.41,11.11 OK1.8 18.1,11.43 18.1,14.13 | 18.1,14.13 16.67,15.56 11.43,15.56 9.68,17.3 7.14,17.3 6.19,16.35 5.08,16.35 4.76,16.03 C1.1 | v12.06,7.94 10.79,7.94 10.79,3.18 11.75,2.22 23.18,2.22 24.13,3.18 24.13,3.81 25.72,5.4 29.69,5.4 29.69,3.33 C6.+ | IC1.20 15.24,25.24 17.62,25.24 IC1.21 | v28.57,36.35 33.02,36.35 R1.2 | ISP.2 28.26,18.1 28.26,18.57 27.3,19.53 25.72,19.53 24.45,18.26 C7.1 | 18.1,14.13 19.21,15.24 v22.7,15.24
  Bottom 0.635: v12.06,7.94 15.08,7.94 18.26,11.11 OK1.8 | ISP.2 32.07,17.46 33.66,17.46 35.72,19.53 35.72,21.75 D2.A | C4.1 15.24,22.07 15.24,25.24 IC1.20 | 24.45,16.99 24.45,18.1 C7.1 24.45,18.41 27.15,21.11 27.15,22.38 26.19,23.34 24.77,23.34 23.97,24.13 23.97,27.15 20.32,30.8 20.32,32.86 IC1.7 | 24.45,16.99 26.83,14.6 IC2.OUT | v28.57,36.35 23.5,36.35 20.32,33.18 IC1.7 | IC1.21 17.62,25.4 17.62,26.83 13.81,30.64 13.81,34.61 13.34,35.08 13.34,36.2 14.29,37.15 16.03,37.15 20,33.18 IC1.7 | 24.45,16.99 v22.7,15.24
VDD
  Top 0.635: R7.1 D3.C
  Bottom 0.635: R8.1 29.21,10 29.05,10.16 R7.1
VREG_IN  (via drill 0.35)
  Top 0.635: C5.1 30.64,19.05 30.16,19.53 28.57,19.53 26.35,21.75 25.72,21.75 D2.C | v21.91,17.46 24.29,15.08 24.29,14.6 IC2.IN
  Bottom 0.635: IC2.IN 24.29,14.6 24.29,11.75 25.4,10.64 25.4,6.35 28.26,3.49 28.26,2.7 29.05,1.91 35.4,1.91 L1.2 | v21.91,17.46 25.56,21.11 25.56,21.75 D2.C
(copper drawn outside any net)
  shapes: Top area x4